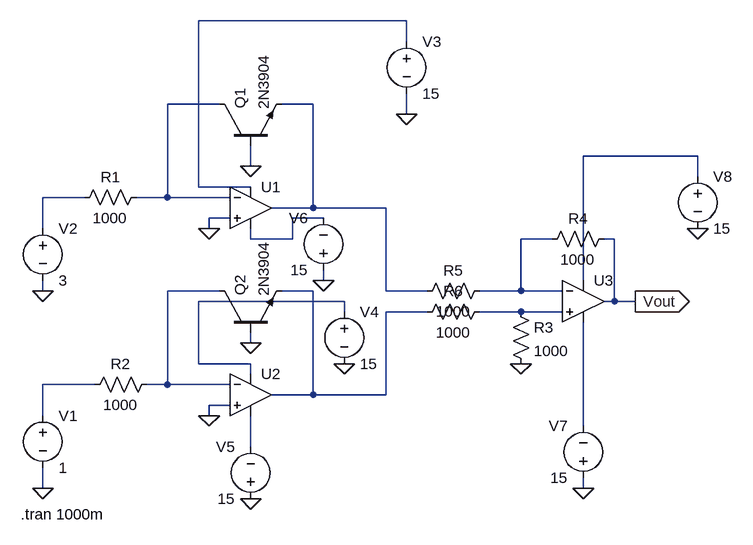
[diagram p0: schematic log_amplifier.asc]
log_amplifier.asc, the LTspice schematic file:
Version 4
SHEET 1 952 680
WIRE 448 -96 128 -96
WIRE 448 -64 448 -96
WIRE 160 32 80 32
WIRE 304 32 256 32
WIRE 448 48 448 16
WIRE 896 112 720 112
WIRE 208 128 208 96
WIRE 896 144 896 112
WIRE 128 160 128 -96
WIRE 208 160 128 160
WIRE -48 176 -112 176
WIRE 80 176 80 32
WIRE 80 176 32 176
WIRE 176 176 80 176
WIRE 304 192 304 32
WIRE 304 192 240 192
WIRE 416 192 304 192
WIRE 176 208 144 208
WIRE 320 208 272 208
WIRE -112 224 -112 176
WIRE 144 224 144 208
WIRE 208 240 208 224
WIRE 272 240 272 208
WIRE 272 240 208 240
WIRE 672 240 624 240
WIRE 768 240 752 240
WIRE 320 304 320 288
WIRE 720 304 720 112
WIRE -112 320 -112 304
WIRE 160 320 80 320
WIRE 304 320 256 320
WIRE 416 320 416 192
WIRE 480 320 416 320
WIRE 624 320 624 240
WIRE 624 320 560 320
WIRE 688 320 624 320
WIRE 352 336 128 336
WIRE 768 336 768 240
WIRE 768 336 752 336
WIRE 800 336 768 336
WIRE 352 352 352 336
WIRE 480 352 416 352
WIRE 624 352 560 352
WIRE 688 352 624 352
WIRE 208 400 208 384
WIRE 128 432 128 336
WIRE 208 432 128 432
WIRE 208 448 208 432
WIRE -32 464 -112 464
WIRE 80 464 80 320
WIRE 80 464 48 464
WIRE 176 464 80 464
WIRE 304 480 304 320
WIRE 304 480 240 480
WIRE 416 480 416 352
WIRE 416 480 304 480
WIRE 176 496 144 496
WIRE -112 512 -112 464
WIRE 144 512 144 496
WIRE 720 528 720 368
WIRE 208 560 208 512
WIRE -112 624 -112 592
WIRE 720 624 720 608
FLAG 208 128 0
FLAG 208 400 0
FLAG 800 336 Vout
IOPIN 800 336 Out
FLAG 720 624 0
FLAG 448 48 0
FLAG 896 224 0
FLAG 320 304 0
FLAG 352 432 0
FLAG 208 640 0
FLAG -112 320 0
FLAG -112 624 0
FLAG 624 432 0
FLAG 144 224 0
FLAG 144 512 0
SYMBOL OpAmps\\UniversalOpamp2 208 192 R0
SYMATTR InstName U1
SYMBOL OpAmps\\UniversalOpamp2 208 480 R0
SYMATTR InstName U2
SYMBOL npn 160 96 R270
SYMATTR InstName Q1
SYMATTR Value 2N3904
SYMBOL npn 160 384 R270
SYMATTR InstName Q2
SYMATTR Value 2N3904
SYMBOL res 48 160 R90
WINDOW 0 0 56 VBottom 2
WINDOW 3 32 56 VTop 2
SYMATTR InstName R1
SYMATTR Value 1000
SYMBOL res 64 448 R90
WINDOW 0 0 56 VBottom 2
WINDOW 3 32 56 VTop 2
SYMATTR InstName R2
SYMATTR Value 1000
SYMBOL OpAmps\\UniversalOpamp2 720 336 R0
SYMATTR InstName U3
SYMBOL voltage -112 496 R0
WINDOW 123 0 0 Left 0
WINDOW 39 0 0 Left 0
SYMATTR InstName V1
SYMATTR Value 1
SYMBOL voltage 448 -80 R0
WINDOW 123 0 0 Left 0
WINDOW 39 0 0 Left 0
SYMATTR InstName V3
SYMATTR Value 15
SYMBOL voltage 352 336 R0
WINDOW 123 0 0 Left 0
WINDOW 39 0 0 Left 0
SYMATTR InstName V4
SYMATTR Value 15
SYMBOL voltage 208 656 R180
WINDOW 0 24 96 Left 2
WINDOW 3 24 16 Left 2
WINDOW 123 0 0 Left 0
WINDOW 39 0 0 Left 0
SYMATTR InstName V5
SYMATTR Value 15
SYMBOL voltage 320 304 R180
WINDOW 0 24 96 Left 2
WINDOW 3 24 16 Left 2
WINDOW 123 0 0 Left 0
WINDOW 39 0 0 Left 0
SYMATTR InstName V6
SYMATTR Value 15
SYMBOL voltage 720 624 R180
WINDOW 0 24 96 Left 2
WINDOW 3 24 16 Left 2
WINDOW 123 0 0 Left 0
WINDOW 39 0 0 Left 0
SYMATTR InstName V7
SYMATTR Value 15
SYMBOL voltage 896 128 R0
WINDOW 123 0 0 Left 0
WINDOW 39 0 0 Left 0
SYMATTR InstName V8
SYMATTR Value 15
SYMBOL res 608 336 R0
SYMATTR InstName R3
SYMATTR Value 1000
SYMBOL res 768 224 R90
WINDOW 0 0 56 VBottom 2
WINDOW 3 32 56 VTop 2
SYMATTR InstName R4
SYMATTR Value 1000
SYMBOL res 576 304 R90
WINDOW 0 0 56 VBottom 2
WINDOW 3 32 56 VTop 2
SYMATTR InstName R5
SYMATTR Value 1000
SYMBOL res 576 336 R90
WINDOW 0 0 56 VBottom 2
WINDOW 3 32 56 VTop 2
SYMATTR InstName R6
SYMATTR Value 1000
SYMBOL voltage -112 208 R0
WINDOW 123 0 0 Left 0
WINDOW 39 0 0 Left 0
SYMATTR InstName V2
SYMATTR Value 3
TEXT -146 664 Left 2 !.tran 1000m

The netlist it stands for:
* log_amplifier.asc
XU1 0 N002 N001 N006 N003 level.2 Avol=1Meg GBW=10Meg Slew=10Meg ilimit=25m rail=0 Vos=0 phimargin=45 en=0 enk=0 in=0 ink=0 Rin=500Meg  ; pins IN+ IN- V+ V- OUT
XU2 0 N008 N010 N014 N009 level.2 Avol=1Meg GBW=10Meg Slew=10Meg ilimit=25m rail=0 Vos=0 phimargin=45 en=0 enk=0 in=0 ink=0 Rin=500Meg  ; pins IN+ IN- V+ V- OUT
Q1 N002 0 N003 0 2N3904
Q2 N008 0 N009 0 2N3904
R1 N002 N005 1000
R2 N008 N012 1000
XU3 N011 N007 N004 N013 Vout level.2 Avol=1Meg GBW=10Meg Slew=10Meg ilimit=25m rail=0 Vos=0 phimargin=45 en=0 enk=0 in=0 ink=0 Rin=500Meg  ; pins IN+ IN- V+ V- OUT
V1 N012 0 1
V3 N001 0 15
V4 N010 0 15
V5 0 N014 15
V6 0 N006 15
V7 0 N013 15
V8 N004 0 15
R3 N011 0 1000
R4 Vout N007 1000
R5 N007 N003 1000
R6 N011 N009 1000
V2 N005 0 3
.model NPN NPN
.model PNP PNP
.lib standard.bjt
.tran 1000m
.lib UniversalOpamps2.sub
.backanno
.end